# Altium project PowerSystem.PrjPcb
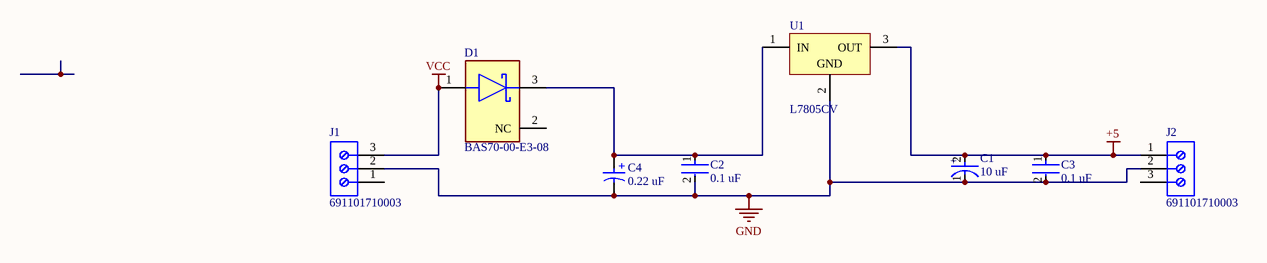
[diagram p0: PowerSystem.SchDoc]
1 sheet, 8 parts. Net scope: global (net labels, ports and power ports of the same name join across sheets).
Board file: PowerSystem.PcbDoc

## Sheet PowerSystem.SchDoc
size A; SheetNumber: 1; SheetTotal: 1

### Parts
C1  10 uF  [FP-RAD-TH-D_5_0_5-L_11_1-MFG]
C2  0.1 uF  [FP-RDE0P1-MFG]
C3  0.1 uF  [FP-RDE0P1-MFG]
C4  0.22 uF  [WCAP-ATG8_D5H11]
D1  BAS70-00-E3-08  [FP-6_541-5014_01-4-MFG]
J1  691101710003  [691101710003]
J2  691101710003  [691101710003]
U1  L7805CV  [TO220]

### Nets
+5: C1.2(A) C3.1 J2.1 U1.3(OUT)
GND: C1.1(C) C2.2 C3.2 C4.2(N) J1.2 J2.2 U1.2(GND)
VCC: D1.1(A) J1.3
NetC2_1: C2.1 C4.1(P) D1.3(C) U1.1(IN)

Not connected (* = marked no-connect by the designer): D1 2(NC); J1 1; J2 3

### Notes on the sheet
- (in symbol CMP-03913-54007281-1) +
- (in symbol CMP-05427-001295-1) +

### Library data of the parts
C1 = CMP-05427-001295-1: Aluminum Electrolytic Capacitors (Radial Lead Type) 10uF ±20% 50V; Lead Diameter: 0.5mm; Life (Hours): 5000Hour; Impedance: 340mR; Ripple Current (AC): 250mA; REACH SVHC: Yes; Tolerance: 20%; Construction: RADIAL; Min Operating Temperature: -40°C; Termination: Radial; Voltage Rating: 50V; Height: 11mm; Max Operating Temperature: 105°C; Capacitance: 10uF; Voltage: 50V; Diameter: 5mm; Lead Pitch: 2mm; Series: FR Radial; RoHS Compliant: Yes; Case/Package: Radial
C2 C3 = CMP-06035-036375-1: Ceramic Capacitor 100nF ±10% 25V X7R Radial; Lead Diameter: 0.5mm; Mount: Through Hole; Resistor Type: Ceramic; Case/Package: Radial; Height - Seated (Max): 0.236inch; Lead Pitch: 0.098inch; Lead Free: Lead Free; Voltage Rating (DC): 25V; Width: 0.098inch; Packaging: Bulk; Dielectric: X7R; Tolerance: 10%; Min Operating Temperature: -55°C; Capacitance: 100nF; Max Operating Temperature: 125°C; Termination: Radial; Height: 3.5mm; Package Quantity: 500; Voltage Rating: 25V; Length: 0.197inch
C4 = CMP-03913-54007281-1: 860010772002 WCAP-ATG8 Aluminum Electrolytic Capacitors; Polarity: Polar; Voltage Rating: 63V; Dissipation Factor: 9%; Tolerance: 20%; Capacitance: 220nF; Leakage Current: 3µA; Pitch: 2mm; Life (Hours): 2000hours; Ripple Current: 4mA; Diameter: 5mm; NexarPartId: 54007281; RoHS: Compliant; Lead Pitch: 2.0066mm; Min Operating Temperature: -40°C; Max Operating Temperature: 85°C; Case/Package: Radial; Height - Seated (Max): 12.4968mm; Mount: Through Hole; Height: 11mm; REACH SVHC: Unknown; Voltage Rating (DC): 63V; Length: 11mm; Packaging: Tape & Box (TB)
D1 = CMP-02539-000005-1: DIODE SCHOTTKY 70V 200MA SOT23; Manufacturer: Vishay; Max Surge Forward Current: 600mA; Peak Reverse Current: 0.02uA; Value: 1.5pF; Description: Diode Small Signal Schottky 70V 0.2A 3-Pin SOT-23 T/R; Max Junction Temp: +125°C; Temperature Range High: +125°C; Device Class L1: Discrete Semiconductors; Height: 1.15mm; Temperature: -55°C to +125°C; Mouser Description: Schottky Diodes & Rectifiers 70 Volt 200mA Single; Manufacturer Part Number: BAS70-00-E3-08; Reverse Voltage: 70V; Device Class L3: Schottky Diodes; Temperature Range Low: -55°C; Package: 6.541-5014.01-4; RoHS: TRUE; Automotive: No; Capacitance: 1.5pF; Max Repetitive Reverse Voltage: 70V; ComponentLink2URL: https://www.vishay.com/docs/85702/bas70.pdf; Category: Diode; Octopart: https://octopart.com/bas70-00-e3-08-vishay-30324832; Forward Current: 200mA; Lead Free: Yes; Device Class L2: Diodes; Digikey Description: DIODE SCHOTTKY 70V 200MA SOT23; ComponentLink2Description: Datasheet
J1 J2 = CMP-1502-03257-2: NexarPartId: 8917705; Voltage Rating: 250V; Current: 16A; Wire Gauge (Min): 14AWG; Pitch: 5.0038mm; Wire Gauge (Max): 26AWG; Number of Positions Per Level: 3; Plating: Steel; Number of Levels: 1; Stripping Length: -7mm; REACH SVHC: Unknown; Width: 16.2mm; Height: 16.4mm; Contact Material: Brass; RoHS: Compliant; Color: Blue; Contact Plating: Tin; Lead Pitch: 5mm; Packaging: Box; Termination: Screw; Number of Contacts: 3; Wire/Cable Gauge: 26AWG; Min Operating Temperature: -40°C; Max Operating Temperature: 105°C; Housing Material: Nylon; Length: 9mm; Voltage: 250V; Mount: Through Hole; Current Rating: 16A; Number of Pins: 3
U1 = CMP-0244-00483-1: Positive Voltage Regulator, 5V, 3-Pin TO-220; PackageDescription: TO, Thru-Hole, Vertical, Heatsink Mounted; 3 In-Line Leads; Pitch 2.54 mm; ComponentLink2Description: Datasheet; PackageReference: TO220; ComponentLink3URL: http://www.st.com/internet/com/TECHNICAL_RESOURCES/TECHNICAL_LITERATURE/PACKAGE_INFORMATION/CD00004649.pdf; DatasheetVersion: 16/11/2011; ComponentLink1Description: Manufacturer URL; ComponentLink1URL: http://www.st.com; PackageVersion: ver3.0; ComponentLink3Description: Package Specification; ComponentLink2URL: http://www.st.com/internet/com/TECHNICAL_RESOURCES/TECHNICAL_LITERATURE/DATASHEET/CD00000444.pdf